# Altium schematic sheet PAGE2 - EnviromentalBoard.SchDoc
size A3
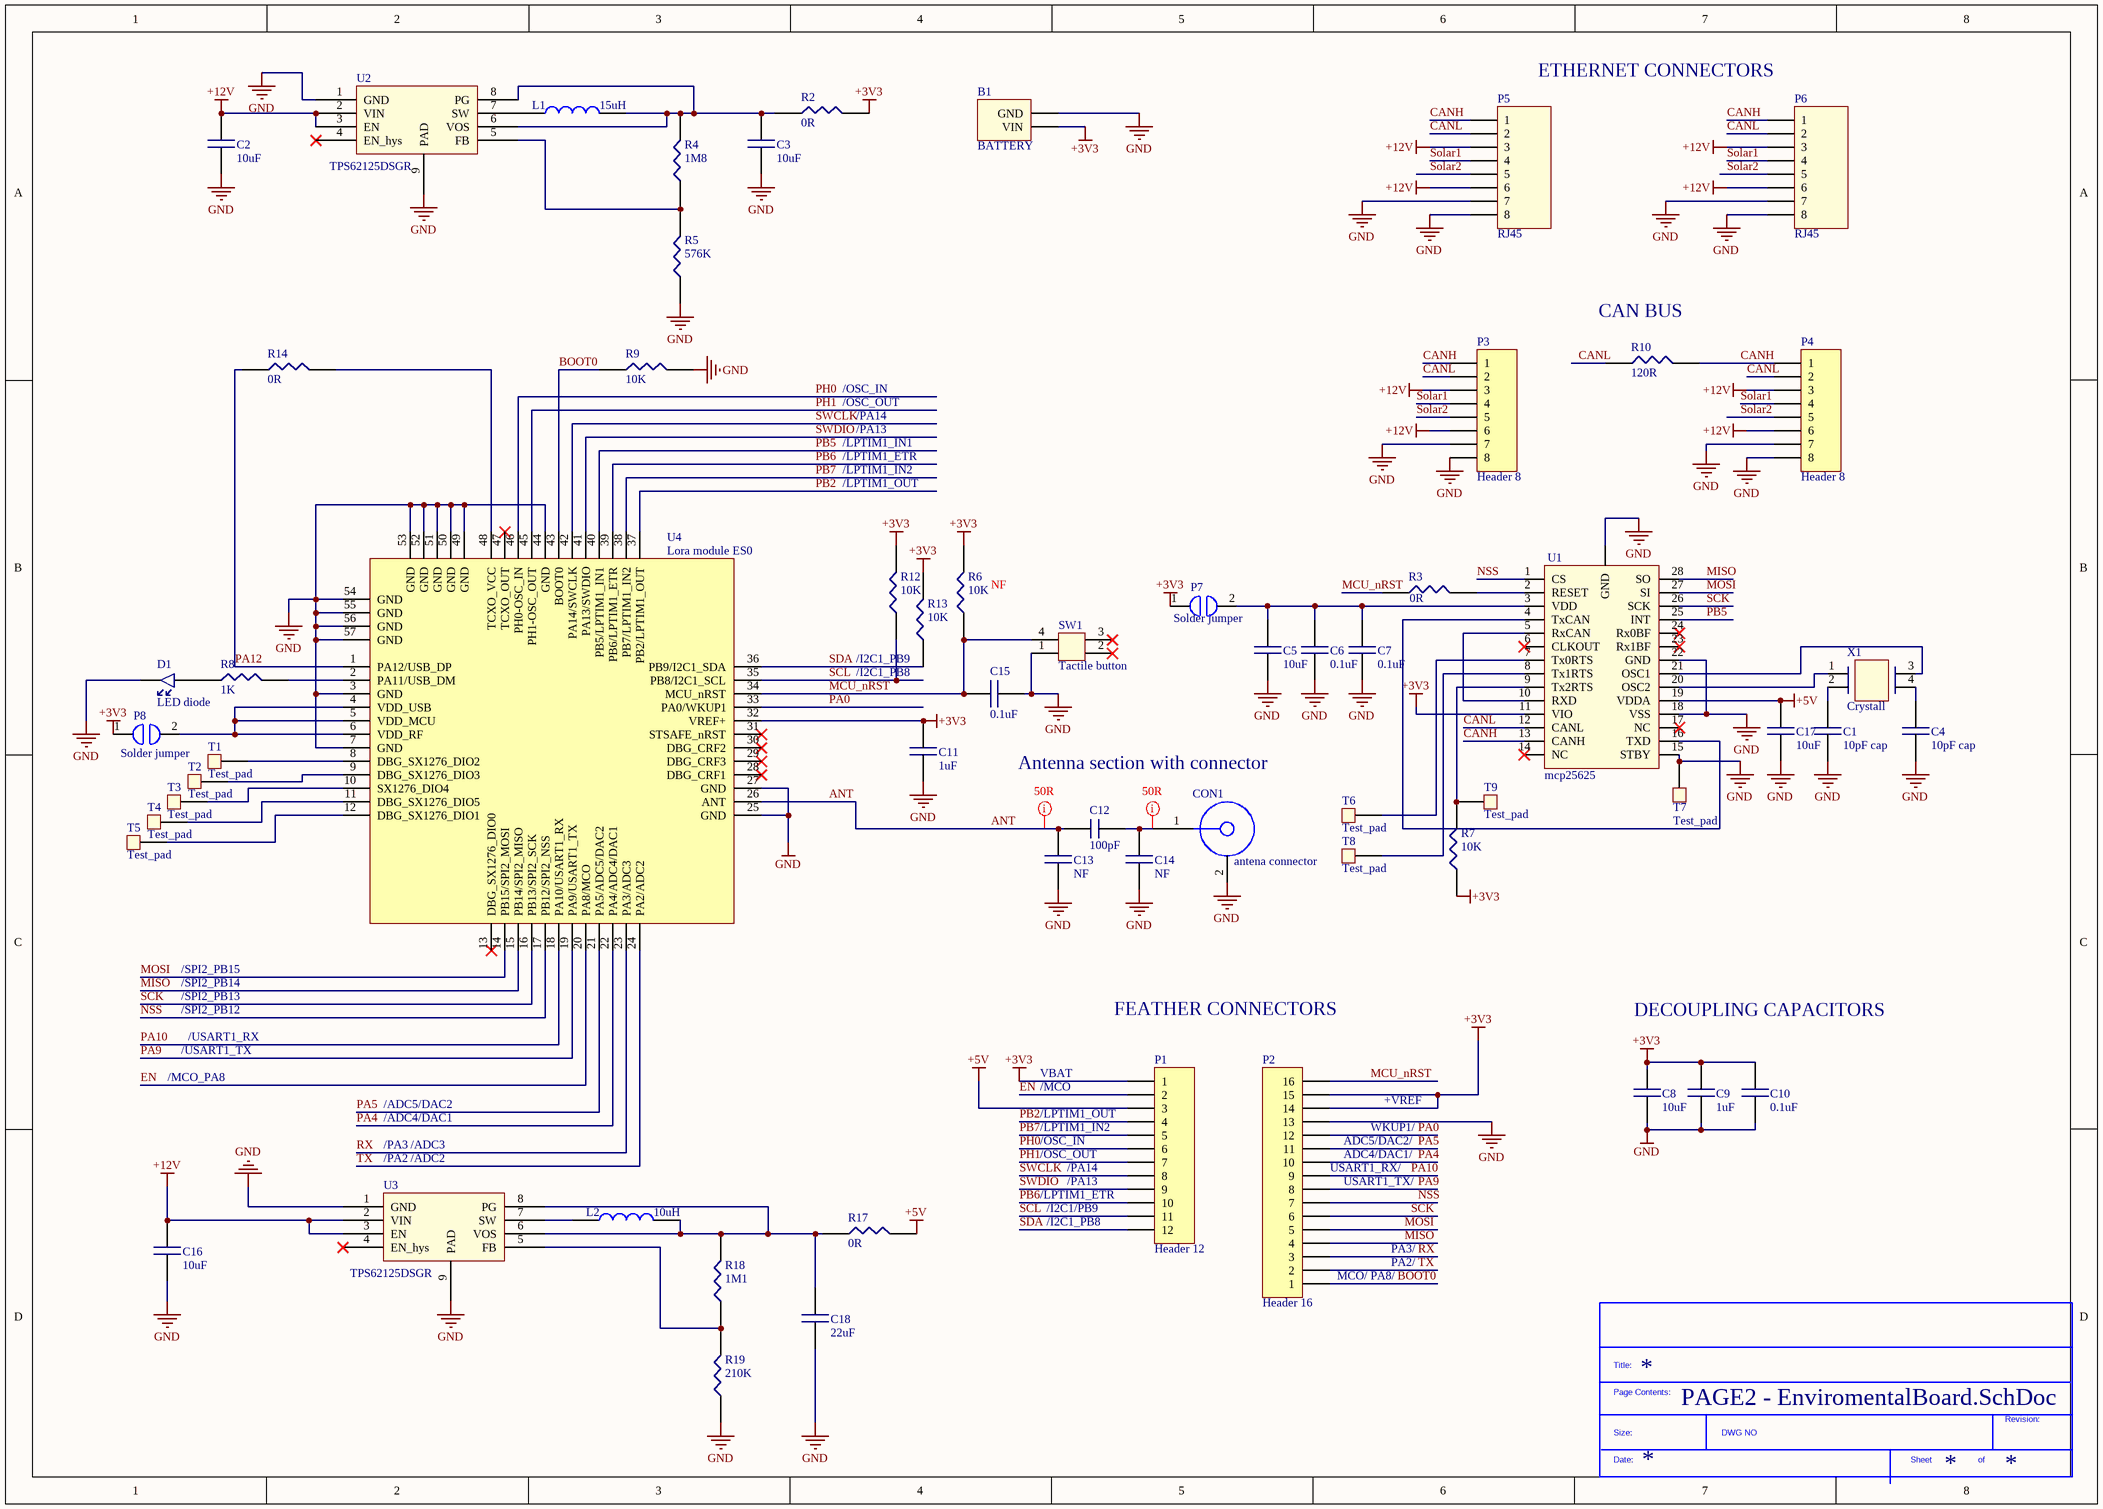
[diagram p0: PAGE2 - EnviromentalBoard.SchDoc]

## Parts
*?  SDTitleBlock  (value not drawn)  (graphical)
B1  BATTERY  [BAT_CON]
C1  10pF cap  [0603Cap]
C2  10uF  [0603Cap]
C3  10uF  [0603Cap]
C4  10pF cap  [0603Cap]
C5  10uF  [0603Cap]
C6  0.1uF  [0603Cap]
C7  0.1uF  [0603Cap]
C8  10uF  [0603Cap]
C9  1uF  [0603Cap]
C10  0.1uF  [0603Cap]
C11  1uF  [0603Cap]
C12  100pF  [0402CAP]
C13  NF  [0402CAP]
C14  NF  [0402CAP]
C15  0.1uF  [0603Cap]
C16  10uF  [0603Cap]
C17  10uF  [0603Cap]
C18  22uF  [0603Cap]
CON1  antena connector  [uFL SMD CONNECTOR]
D1  LED diode  [LED]
L1  15uH  [Inductor 3.0x2.5]
L2  10uH  [Inductor 3.0x2.5]
P1  Header 12  [HDR1X12]
P2  Header 16  [HDR1X16]
P3  Header 8  [HDR1X8]
P4  Header 8  [HDR1X8]
P5  RJ45  [EThernet conn]
P6  RJ45  [EThernet conn]
P7  Solder jumper  [SOLDER JUMPER]
P8  Solder jumper  [SOLDER JUMPER]
R2  0R  [0603Res]
R3  0R  [0603Res]
R4  1M8  [0603Res]
R5  576K  [0603Res]
R6  10K  [0603Res]
R7  10K  [0603Res]
R8  1K  [0603Res]
R9  10K  [0603Res]
R10  120R  [0603Res]
R12  10K  [0603Res]
R13  10K  [0603Res]
R14  0R  [0603Res]
R17  0R  [0603Res]
R18  1M1  [0603Res]
R19  210K  [0603Res]
SW1  Tactile button  [Tactile button]
T1  Test_pad  [Test_Pad]
T2  Test_pad  [Test_Pad]
T3  Test_pad  [Test_Pad]
T4  Test_pad  [Test_Pad]
T5  Test_pad  [Test_Pad]
T6  Test_pad  [Test_Pad]
T7  Test_pad  [Test_Pad]
T8  Test_pad  [Test_Pad]
T9  Test_pad  [Test_Pad]
U1  mcp25625  [MCP25625]
U2  TPS62125DSGR  [WSON-Voltage regulator]
U3  TPS62125DSGR  [WSON-Voltage regulator]
U4  Lora module ES0  [LORA MODULE ES0]
X1  Crystall  [IQXC-42]

## Nets
+3V3: B1.1(VIN) C8.1 C9.1 C10.2 C11.2 P1.1 P2.14 P2.15 P7.1 P8.1 R2.2 R6.2 R7.1 R12.2 R13.2 U1.11(VIO) U4.32(VREF+)
+5V: C17.1 P1.3 R17.2 U1.19(VDDA)
+12V: C2.1 C16.1 P3.3 P3.6 P4.3 P4.6 P5.3 P5.6 P6.3 P6.6 U2.2(VIN) U2.3(EN) U3.2(VIN) U3.3(EN)
GND: B1.2(GND) C1.1 C2.2 C3.2 C4.1 C5.2 C6.1 C7.1 C8.2 C9.2 C10.1 C11.1 C13.1 C14.1 C15.2 C16.2 C17.2 C18.1 CON1.2 D1.1 P2.13 P3.7 P3.8 P4.7 P4.8 P5.7 P5.8 P6.7 P6.8 R5.1 R9.2 R19.1 SW1.1 T7.1 U1.15(STBY) U1.18(VSS) U1.22(GND) U1.29(GND) U2.1(GND) U2.9(PAD) U3.1(GND) U3.9(PAD) U4.3(GND) U4.7(GND) U4.25(GND) U4.27(GND) U4.44(GND) U4.49(GND) U4.50(GND) U4.51(GND) U4.52(GND) U4.53(GND) U4.54(GND) U4.55(GND) U4.56(GND) U4.57(GND)
ANT: C12.1 C13.2 U4.26(ANT)
BOOT0: P2.1 R9.1 U4.43(BOOT0)
CANH: P3.1 P4.1 P5.1 P6.1 R10.2 U1.13(CANH)
CANL: P3.2 P4.2 P5.2 P6.2 R10.1 U1.12(CANL)
EN: P1.2 U4.20(PA8/MCO)
MCU_nRST: C15.1 P2.16 R3.1 R6.1 SW1.4 U4.34(MCU_nRST)
MISO: P2.4 U1.28(SO) U4.15(PB14/SPI2_MISO)
MOSI: P2.5 U1.27(SI) U4.14(PB15/SPI2_MOSI)
NSS: P2.7 U1.1(CS) U4.17(PB12/SPI2_NSS)
PA0: P2.12 U4.33(PA0/WKUP1)
PA4: P2.10 U4.22(PA4/ADC4/DAC1)
PA5: P2.11 U4.21(PA5/ADC5/DAC2)
PA9: P2.8 U4.19(PA9/USART1_TX)
PA10: P2.9 U4.18(PA10/USART1_RX)
PA12: R14.1 U4.1(PA12/USB_DP)
PB2: P1.4 U4.37(PB2/LPTIM1_OUT)
PB5: U1.25(INT) U4.40(PB5/LPTIM1_IN1)
PB6: P1.10 U4.39(PB6/LPTIM1_ETR)
PB7: P1.5 U4.38(PB7/LPTIM1_IN2)
PH0: P1.6 U4.46(PH0-OSC_IN)
PH1: P1.7 U4.45(PH1-OSC_OUT)
RX: P2.3 U4.23(PA3/ADC3)
SCK: P2.6 U1.26(SCK) U4.16(PB13/SPI2_SCK)
SCL: P1.11 R12.1 U4.35(PB8/I2C1_SCL)
SDA: P1.12 R13.1 U4.36(PB9/I2C1_SDA)
Solar1: P3.4 P4.4 P5.4 P6.4
Solar2: P3.5 P4.5 P5.5 P6.5
SWCLK: P1.8 U4.42(PA14/SWCLK)
SWDIO: P1.9 U4.41(PA13/SWDIO)
TX: P2.2 U4.24(PA2/ADC2)
NetC1_2: C1.2 X1.2
NetC3_1: C3.1 L1.2 R2.1 R4.2 U2.6(VOS) U2.8(PG)
NetC4_2: C4.2 X1.4
NetC5_1: C5.1 C6.2 C7.2 P7.2 U1.3(VDD)
NetC12_2: C12.2 C14.2 CON1.1
NetC18_2: C18.2 L2.2 R17.1 R18.2 U3.6(VOS) U3.8(PG)
NetD1_2: D1.2 R8.1
NetL1_1: L1.1 U2.7(SW)
NetL2_1: L2.1 U3.7(SW)
NetP8_2: P8.2 U4.4(VDD_USB) U4.5(VDD_MCU) U4.6(VDD_RF)
NetR3_2: R3.2 U1.2(RESET)
NetR4_1: R4.1 R5.2 U2.5(FB)
NetR7_2: R7.2 T9.1 U1.9(Tx2RTS)
NetR8_2: R8.2 U4.2(PA11/USB_DM)
NetR14_2: R14.2 U4.48(TCXO_VCC)
NetR18_1: R18.1 R19.2 U3.5(FB)
NetT1_1: T1.1 U4.8(DBG_SX1276_DIO2)
NetT2_1: T2.1 U4.9(DBG_SX1276_DIO3)
NetT3_1: T3.1 U4.10(SX1276_DIO4)
NetT4_1: T4.1 U4.11(DBG_SX1276_DIO5)
NetT5_1: T5.1 U4.12(DBG_SX1276_DIO1)
NetT6_1: T6.1 U1.7(Tx0RTS)
NetT8_1: T8.1 U1.8(Tx1RTS)
NetU1_4: U1.4(TxCAN) U1.16(TXD)
NetU1_5: U1.5(RxCAN) U1.10(RXD)
NetU1_20: U1.20(OSC2) X1.1
NetU1_21: U1.21(OSC1) X1.3

Not connected (* = marked no-connect by the designer): SW1 2* 3*; U1 6(CLKOUT)* 14(NC)* 17(NC)* 23(Rx1BF)* 24(Rx0BF)*; U2 4(EN_hys)*; U3 4(EN_hys)*; U4 13(DBG_SX1276_DIO0)* 28(DBG_CRF1)* 29(DBG_CRF3)* 30(DBG_CRF2)* 31(STSAFE_nRST)* 47(TCXO_OUT)*

## Layout directives
net class 50R; rule Clearance Constraint [Clearance = 6.2mil]: ANT, NetC12_2

## Notes on the sheet
- ETHERNET CONNECTORS
- (near R10) CAN BUS
- /OSC_IN
- /OSC_OUT
- /LPTIM1_IN1
- /PA14
- /PA13
- /LPTIM1_ETR
- /LPTIM1_IN2
- /LPTIM1_OUT
- (near R6) NF
- (near R13) /I2C1_PB9
- (near R13) /I2C1_PB8
- Antenna section with connector
- /SPI2_PB15
- /SPI2_PB14
- /SPI2_PB13
- /USART1_TX
- /SPI2_PB12
- /USART1_RX
- FEATHER CONNECTORS
- DECOUPLING CAPACITORS
- /MCO_PA8
- /ADC5/DAC2
- /ADC4/DAC1
- (near P1) /LPTIM1_OUT
- /MCO
- VBAT
- +VREF
- /PA3
- (near U3) /PA2
- /ADC3
- (near U3) /ADC2
- (near P1) /LPTIM1_IN2
- (near P2) USART1_RX/
- (near P2) ADC4/DAC1/
- (near P2) USART1_TX/
- (near P2) ADC5/DAC2/
- WKUP1/
- (near P1) /LPTIM1_ETR
- (near P1) /I2C1/PB9
- (near P1) /I2C1_PB8
- PA3/
- (near P2) MCO/
- PA8/
- PA2/
- (in symbol SDTitleBlock) Title:; Page Contents:; Revision:; Size:; DWG NO; Date:; Sheet; of

## Library data of the parts
B1 = 1862: JST-PH 2-Pin SMT Right Angle Breakout Board; Manufacturer: Adafruit Industries; Supplier 1: Mouser; Manufacturer Part Number: 1862; Stock 1: 115; Pricing 1: 1=1.5, 10=1.5, 50=1.5, 100=1.5, 1000=1.5, 10000=1.5 (USD); Supplier Part Number 1: 485-1862
C1 C4 = 10pF: Cap Ceramic 10pF 50V X7R 10% SMD 0603 125C T/R; Manufacturer: Kyocera AVX; Manufacturer Part Number: 06035C100KAT2A; Supplier 1: Farnell; Stock 1: 0; Capacitance: 10 pF; Case Size/Dimension: 0603; Dielectric: X7R; Tolerance (%): ±10 %; Rated Voltage: 50 V; ComponentLink1URL: https://datasheet.ciiva.com/204/cx7r-204167.pdf; ComponentLink1Description: https://datasheet.ciiva.com/204/cx7r-204167.pdf; ComponentLink2URL: https://datasheet.ciiva.com/28611/1679506-28611544.pdf; ComponentLink2Description: https://datasheet.ciiva.com/28611/1679506-28611544.pdf; ComponentLink3URL: https://datasheet.ciiva.com/22677/1679506-22677033.pdf; ComponentLink3Description: https://datasheet.ciiva.com/22677/1679506-22677033.pdf; ComponentLink4URL: https://datasheet.ciiva.com/16327/cx7r-16327067.pdf; ComponentLink4Description: https://datasheet.ciiva.com/16327/cx7r-16327067.pdf; ComponentLink5URL: https://datasheet.ciiva.com/5416/cx7r-5416268.pdf; ComponentLink5Description: https://datasheet.ciiva.com/5416/cx7r-5416268.pdf; ComponentLink6URL: https://datasheet.ciiva.com/15212/getdatasheetpartid-317346-15212284.pdf; ComponentLink6Description: https://datasheet.ciiva.com/15212/getdatasheetpartid-317346-15212284.pdf; Supplier Part Number 1: 2665201
C2 C3 C5 C8 C16 C17 = 10uF Cap: MURATA         ZRB18AR61E106ME01L             SMD Multilayer Ceramic Capacitor, 0603 [1608 Metric], 10 F, 25 V,  20%, X5R, ZRA Series; Capacitance: 10µF; Voltage - Rated: 25V; Supplier 1: Farnell; Manufacturer: Murata; Manufacturer Part Number: ZRB18AR61E106ME01L; Stock 1: 0; Category: Capacitors; Family: Ceramic Capacitors; Series: ZRB; Packaging: Tape & Reel (TR); Tolerance: ±20%; Temperature Coefficient: X5R; Mounting Type: Surface Mount, MLCC; Operating Temperature: -55°C ~ 85°C; Applications: Acoustic Noise Reduction; Ratings: -; Package / Case: 0603 (1608 Metric); Size / Dimension: 0.063" L x 0.031" W (1.60mm x 0.80mm); Height - Seated (Max): -; Thickness (Max): 0.047" (1.20mm); Lead Spacing: -; Features: Interposer Termination; Lead Style: -; ComponentLink1URL: http://www.farnell.com/datasheets/2243360.pdf; ComponentLink1Description: http://www.farnell.com/datasheets/2243360.pdf; ComponentLink2URL: http://www.farnell.com/datasheets/2163235.pdf; ComponentLink2Description: http://www.farnell.com/datasheets/2163235.pdf; ComponentLink3URL: http://search.murata.co.jp/Ceramy/image/img/A01X/G101/ENG/ZRB18AR61E106ME01-01.pdf; ComponentLink3Description: http://search.murata.co.jp/Ceramy/image/img/A01X/G101/ENG/ZRB18AR61E106ME01-01.pdf; Supplier Part Number 1: 2469398; Pricing 1: 5=0.411, 50=0.187, 250=0.142, 500=0.0978, 1500=0.091 (GBP)
C6 C7 C10 C15 = 0.1uF: Multilayer Ceramic Capacitors MLCC - SMD/SMT .1uF 50Volts X7R +/-10% 0603 STD; Manufacturer: KEMET; Manufacturer Part Number: C0603C104K4RAC7081; Capacitance: 0.1µF; Ceramic Capacitor Case: 0603 [1608 Metric]; Voltage Rating: 16V; Capacitance Tolerance: ± 10%; Product Range: C Series; SVHC: No SVHC (15-Jun-2015); Supplier 1: Farnell; Stock 1: 131460; Pricing 1: 10=0.0639, 100=0.0337, 500=0.0247, 2500=0.0209 (EUR); Packaging: Cut Tape; ComponentLink1URL: http://www.farnell.com/datasheets/2112158.pdf; ComponentLink1Description: http://www.farnell.com/datasheets/2112158.pdf; ComponentLink2URL: http://www.farnell.com/datasheets/2316283.pdf; ComponentLink2Description: http://www.farnell.com/datasheets/2316283.pdf; ComponentLink3URL: https://api.kemet.com/component-edge/download/datasheet/C0603C104K4RAC7081.pdf; ComponentLink3Description: https://api.kemet.com/component-edge/download/datasheet/C0603C104K4RAC7081.pdf; Supplier Part Number 1: 2522597; Dielectric Characteristic: X7R; Operating Temperature Min: -55°C; Operating Temperature Max: 125°C; Automotive Qualification Standard: -; MSL: MSL 1 - Unlimited
C9 C11 = 1uF: 1µF 50V Ceramic Capacitor X5R 0603 (1608 Metric) 0.063" L x 0.031" W (1.60mm x 0.80mm); Manufacturer: TDK; Manufacturer Part Number: C1608X5R1E105K080AC; PCN Part Number: MLCC Part Number Change 30/Nov/2012; Tolerance: ±10%; Voltage - Rated: 25V; Product Training Modules: C Series General Applications SEAT, CCV, and TVCL Design Tools Guide to Replacing an Electrolytic Capacitor with an MLCC; Design Resources: 20 W Non-Isolated Buck LED Driver Using PL LNK460KG; Online Catalog: C Series, General Purpose; Other Names: 445-5146-6; Supplier 1: Farnell; Stock 1: 0; Pricing 1: 10=0.0585, 100=0.0449, 500=0.0335, 1000=0.0279 (GBP); Category: Capacitors; Family: Ceramic Capacitors; Series: C; Packaging: Digi-Reel®; Capacitance: 1µF; Temperature Coefficient: X5R; Mounting Type: Surface Mount, MLCC; Operating Temperature: -55°C ~ 85°C; Applications: General Purpose; Ratings: -; Package / Case: 0603 (1608 Metric); Size / Dimension: 0.063" L x 0.031" W (1.60mm x 0.80mm); Height - Seated (Max): -; Thickness (Max): 0.037" (0.95mm); Lead Spacing: -; Features: -; Lead Style: -; ComponentLink1URL: https://datasheet.ciiva.com/28451/1796654-28451158.pdf; ComponentLink1Description: https://datasheet.ciiva.com/28451/1796654-28451158.pdf; ComponentLink2URL: https://datasheet.ciiva.com/16394/e412-c-16394039.pdf; ComponentLink2Description: https://datasheet.ciiva.com/16394/e412-c-16394039.pdf; Supplier Part Number 1: 2346891; RoHS Information: RoHS Certificate-MLCC; Standard Package: 1; ComponentLink3URL: https://datasheet.ciiva.com/6292/tdkmlcccaprange-6292456.pdf; ComponentLink3Description: https://datasheet.ciiva.com/6292/tdkmlcccaprange-6292456.pdf; ComponentLink4URL: https://datasheet.ciiva.com/6292/tdkmlcccaprange-6292458.pdf; ComponentLink4Description: https://datasheet.ciiva.com/6292/tdkmlcccaprange-6292458.pdf; ComponentLink5URL: https://datasheet.ciiva.com/22676/1571323-22676922.pdf; ComponentLink5Description: https://datasheet.ciiva.com/22676/1571323-22676922.pdf
C12 = 0F: MULTICOMP         MC0402B101K500CT            SMD Multilayer Ceramic Capacitor, MC Series, 100 pF,  10%, X7R, 50 V, 0402 [1005 Metric]; Product Range: MULTICOMP - MC Series; SVHC: To Be Advised; Voltage Rating: 50V; Supplier 1: Farnell; Manufacturer: Multicomp; Manufacturer Part Number: MC0402B101K500CT; Stock 1: 250; Pricing 1: 10=0.0386, 100=0.0239, 500=0.0142, 2500=0.0091 (EUR); Capacitance: 100pF; Capacitance Tolerance: ± 10%; Capacitor Case Style: 0402 [1005 Metric]; Capacitor Terminals: SMD; Ceramic Capacitor Case: 0402 [1005 Metric]; Dielectric Characteristic: X7R; MSL: -; Operating Temperature Max: 125°C; Operating Temperature Min: -55°C; Packaging: Tape & Reel; ComponentLink1URL: https://datasheet.ciiva.com/36858/1870456-36858427.pdf; ComponentLink1Description: https://datasheet.ciiva.com/36858/1870456-36858427.pdf; ComponentLink2URL: https://datasheet.ciiva.com/36857/1825492-36857949.pdf; ComponentLink2Description: https://datasheet.ciiva.com/36857/1825492-36857949.pdf; ComponentLink3URL: https://datasheet.ciiva.com/36858/1870456-36858493.pdf; ComponentLink3Description: https://datasheet.ciiva.com/36858/1870456-36858493.pdf; Supplier Part Number 1: 1758968
C13 C14 = Cap0402
C18 = 22uF: MURATA         ZRB18AR60J226ME01L             SMD Multilayer Ceramic Capacitor, 0603 [1608 Metric], 22 F, 6.3 V,  20%, X5R, ZRA Series; Capacitance: 22µF; Voltage - Rated: 6.3V; Supplier 1: Farnell; Manufacturer: Murata; Manufacturer Part Number: ZRB18AR60J226ME01L; Stock 1: 4282; Pricing 1: 5=0.54, 50=0.246, 250=0.175, 500=0.129, 1500=0.111 (EUR); Category: Capacitors; Family: Ceramic Capacitors; Series: ZRB; Packaging: Tape & Reel (TR); Tolerance: ±20%; Temperature Coefficient: X5R; Mounting Type: Surface Mount, MLCC; Operating Temperature: -55°C ~ 85°C; Applications: Acoustic Noise Reduction; Ratings: -; Package / Case: 0603 (1608 Metric); Size / Dimension: 0.063" L x 0.031" W (1.60mm x 0.80mm); Height - Seated (Max): -; Thickness (Max): 0.047" (1.20mm); Lead Spacing: -; Features: Derating Recommended, Interposer Termination; Lead Style: -; Supplier Part Number 1: 2469395
CON1 = U.FL-R-SMT-1(10): CONN UMC JACK STR 50 OHM SMD; Manufacturer: Hirose; Featured Product: U.FL Series Connectors; Connector Style: U.FL, Ultra Miniature Coaxial; Connector Type: Receptacle, Male Pin; Contact Termination: Solder; Impedance: 50 Ohm; Frequency - Max: 6GHz; Body Material: Phosphor Bronze; Body Finish: Silver; Center Contact Material: Brass; Center Contact Plating: Gold; Dielectric Material: Liquid Crystal Polymer (LCP); Online Catalog: UMCC (Ultra Miniature Coax Connectors), U.FL Series; Other Names: H11891TR  Q5400621  U.FL-R-SMT-1 10  U.FL-R-SMT-1(10)-ND  UFLRSMT110; Supplier 1: Farnell; Manufacturer Part Number: U.FL-R-SMT-1(10); Stock 1: 38546; Pricing 1: 10=0.49, 100=0.476, 500=0.424, 1000=0.394, 2500=0.386, 5000=0.378 (GBP); Standard Package: 2,500; Category: Connectors, Interconnects; Family: Coaxial Connectors (RF); Series: U.FL; Packaging: Tape & Reel (TR); Shield Termination: Solder; Mounting Type: Surface Mount; Cable Group: -; Fastening Type: Snap-On; Features: -; Housing Color: Beige; Ingress Protection: -; Voltage Rating: -; Operating Temperature: -40°C ~ 90°C; ComponentLink1URL: https://datasheet.ciiva.com/11762/0900766b8105243f-11762474.pdf; ComponentLink1Description: https://datasheet.ciiva.com/11762/0900766b8105243f-11762474.pdf; ComponentLink2URL: https://datasheet.ciiva.com/7651/91524-7651914.pdf; ComponentLink2Description: https://datasheet.ciiva.com/7651/91524-7651914.pdf; ComponentLink3URL: https://datasheet.ciiva.com/7651/91524-7651915.pdf; ComponentLink3Description: https://datasheet.ciiva.com/7651/91524-7651915.pdf; Supplier Part Number 1: 1688077
D1 = LED: Manufacturer: Kingbright; Manufacturer Part Number: KPG1-1608VGC-TT-5MAV; Supplier 1: Farnell; Stock 1: 3955; Pricing 1: 5=0.579, 25=0.542, 100=0.504, 250=0.48, 500=0.443, 1000=0.406 (EUR); ComponentLink1URL: http://www.farnell.com/datasheets/2163492.pdf; ComponentLink1Description: http://www.farnell.com/datasheets/2163492.pdf; Supplier Part Number 1: 2671383
L1 = 15uH inductor: Fixed Inductors 15uH 0.28ohms 0.56A; Manufacturer: TDK; Manufacturer Part Number: VLF302515MT-150M; Unit PriceUSD: VLF-MT; Type: Wirewound; Material - Core: Ferrite; Inductance: 15µH; Tolerance: ±20%; Current Rating: 500mA; Shielding: Shielded; DC Resistance (DCR): 330 mOhm Max; Frequency - Test: 1MHz; Dynamic Catalog: VLF-M and VLF-MT Series; Other Names: 445-9635-6; Supplier 1: Farnell; Stock 1: 1162; Pricing 1: 5=1.46, 50=0.912, 250=0.895, 500=0.698, 1000=0.621, 2000=0.589, 10000=0.557 (EUR); Standard Package: 1; Category: Inductors, Coils, Chokes; Family: Fixed Inductors; Series: VLF-MT; Packaging: Digi-Reel®; Current - Saturation: 500mA; Operating Temperature: -40°C ~ 105°C; Mounting Type: Surface Mount; Package / Case: Non Standard; Size / Dimension: 0.118" L x 0.098" W (3.00mm x 2.50mm); Height - Seated (Max): 0.059" (1.50mm); ComponentLink1URL: https://datasheet.ciiva.com/46449/1759590-46449866.pdf; ComponentLink1Description: https://datasheet.ciiva.com/46449/1759590-46449866.pdf; Supplier Part Number 1: 2455319
L2 = 10uH: COILCRAFT   LPS3314-103MRB   INDUCTOR, SHLD, 10UH, 20%, 0.65A, SMD; Product Range: LPS3314 Series; Inductance: 10µH; RMS Current (Irms): 650mA; Saturation Current (Isat): 660mA; Inductor Construction: Shielded; DC Resistance Max: 0.33ohm; Power Inductor Case: 3.3mm x 3.3mm x 1.3mm; SVHC: No SVHC (15-Jun-2015); Supplier 1: Farnell; Manufacturer: Coilcraft; Manufacturer Part Number: LPS3314-103MRB; Stock 1: 67; Pricing 1: 1=0.892, 250=0.701, 500=0.55 (EUR); Inductance Tolerance: ± 20%; Packaging: Cut Tape; ComponentLink1URL: https://datasheet.ciiva.com/46384/1805322-46384791.pdf; ComponentLink1Description: https://datasheet.ciiva.com/46384/1805322-46384791.pdf; ComponentLink2URL: https://datasheet.ciiva.com/46438/1805322-46438520.pdf; ComponentLink2Description: https://datasheet.ciiva.com/46438/1805322-46438520.pdf; Supplier Part Number 1: 2408046
P1 = Header 12: Header, 12-Pin; LatestRevisionDate: 17-Jul-2002; LatestRevisionNote: Re-released for DXP Platform.; Publisher: Altium Limited
P2 = Header 16: Header, 16-Pin; LatestRevisionDate: 17-Jul-2002; LatestRevisionNote: Re-released for DXP Platform.; Publisher: Altium Limited
P3 P4 = Header 8: Header, 8-Pin; LatestRevisionDate: 17-Jul-2002; LatestRevisionNote: Re-released for DXP Platform.; Publisher: Altium Limited
P5 P6 = 44620-0001: MODULAR JACK; Manufacturer: Molex; Number of Contacts: 8; Rad Hard: No; Gender: RCP; Pitch: 2.04 mm; Body Orientation: Right Angle; Supplier 1: Farnell; Manufacturer Part Number: 44620-0001; Stock 1: 1202; Pricing 1: 1=0.689, 50=0.675, 100=0.67, 250=0.669, 500=0.668, 1000=0.667 (EUR); Type: RJ-45; Termination Method: Solder; Mounting: Through Hole; Category: Connector Telephone and Telecom; ComponentLink1URL: https://datasheet.ciiva.com/26929/getdatasheetpartid-767379-26929525.pdf; ComponentLink1Description: https://datasheet.ciiva.com/26929/getdatasheetpartid-767379-26929525.pdf; ComponentLink2URL: https://datasheet.ciiva.com/19472/2040276-19472615.pdf; ComponentLink2Description: https://datasheet.ciiva.com/19472/2040276-19472615.pdf; ComponentLink3URL: https://datasheet.ciiva.com/30213/71510446200001-modular-jacks-plug-30213975.pdf; ComponentLink3Description: https://datasheet.ciiva.com/30213/71510446200001-modular-jacks-plug-30213975.pdf; ComponentLink4URL: https://datasheet.ciiva.com/4562/0446200001-modular-jacks-plug-145952-4562632.pdf; ComponentLink4Description: https://datasheet.ciiva.com/4562/0446200001-modular-jacks-plug-145952-4562632.pdf; ComponentLink5URL: https://datasheet.ciiva.com/16074/832720446200001-modular-jacks-plug-16074650.pdf; ComponentLink5Description: https://datasheet.ciiva.com/16074/832720446200001-modular-jacks-plug-16074650.pdf; ComponentLink6URL: https://datasheet.ciiva.com/1107/66995-1107778.pdf; ComponentLink6Description: https://datasheet.ciiva.com/1107/66995-1107778.pdf; ComponentLink7URL: https://datasheet.ciiva.com/9393/0446200001-modular-jacks-plug-9393019.pdf; ComponentLink7Description: https://datasheet.ciiva.com/9393/0446200001-modular-jacks-plug-9393019.pdf; ComponentLink8URL: https://datasheet.ciiva.com/16649/0446200001-modular-jacks-plug-16649582.pdf; ComponentLink8Description: https://datasheet.ciiva.com/16649/0446200001-modular-jacks-plug-16649582.pdf; Supplier Part Number 1: 2782009
P7 P8 = Solder_Jumper
R2 R3 R14 R17 = 0R: RES SMD 0.0OHM JUMPER 1/10W 0603; Manufacturer: Vishay; Manufacturer Part Number: CRCW06030000Z0EA; EDA / CAD Models: Download from Accelerated Designs; Resistance (Ohms): 0.0; Power (Watts): 0.1W, 1/10W; Online Catalog: CRCW - Automotive Series; Kits: 541-1419-ND  - RESISTOR KIT 0-1M 1/10W 6100PCS; Other Names: 541-0.0GCT; Supplier 1: Farnell; Stock 1: 1145000; Pricing 1: 5000=0.0046 (EUR); Standard Package: 1; Category: Resistors; Family: Chip Resistor - Surface Mount; Series: CRCW; Packaging: Cut Tape (CT); Tolerance: Jumper; Composition: Thick Film; Features: Automotive AEC-Q200; Temperature Coefficient: -; Operating Temperature: -55°C ~ 155°C; Package / Case: 0603 (1608 Metric); Supplier Device Package: 0603 (1608 Metric); Size / Dimension: 0.061" L x 0.033" W (1.55mm x 0.85mm); Height: 0.020" (0.50mm); Number of Terminations: 2; ComponentLink1URL: https://datasheet.ciiva.com/2461/dcrcwe3-2461968.pdf; ComponentLink1Description: https://datasheet.ciiva.com/2461/dcrcwe3-2461968.pdf; ComponentLink2URL: https://datasheet.ciiva.com/2461/dcrcwe3-2461969.pdf; ComponentLink2Description: https://datasheet.ciiva.com/2461/dcrcwe3-2461969.pdf; ComponentLink3URL: https://datasheet.ciiva.com/2461/dcrcwe3-2461970.pdf; ComponentLink3Description: https://datasheet.ciiva.com/2461/dcrcwe3-2461970.pdf; ComponentLink4URL: https://datasheet.ciiva.com/8340/dcrcwe3-8340197.pdf; ComponentLink4Description: https://datasheet.ciiva.com/8340/dcrcwe3-8340197.pdf; ComponentLink5URL: https://datasheet.ciiva.com/16941/dcrcw-16941302.pdf; ComponentLink5Description: https://datasheet.ciiva.com/16941/dcrcw-16941302.pdf; ComponentLink6URL: https://datasheet.ciiva.com/16199/dcrcwe3-16199063.pdf; ComponentLink6Description: https://datasheet.ciiva.com/16199/dcrcwe3-16199063.pdf; ComponentLink7URL: https://datasheet.ciiva.com/16725/70201119-16725175.pdf; ComponentLink7Description: https://datasheet.ciiva.com/16725/70201119-16725175.pdf; ComponentLink8URL: https://datasheet.ciiva.com/26316/fld-crcw-e3-data-en-26316615.pdf; ComponentLink8Description: https://datasheet.ciiva.com/26316/fld-crcw-e3-data-en-26316615.pdf; ComponentLink9URL: https://datasheet.ciiva.com/5544/dcrcwe3-109170-5544344.pdf; ComponentLink9Description: https://datasheet.ciiva.com/5544/dcrcwe3-109170-5544344.pdf; ComponentLink10URL: https://datasheet.ciiva.com/7841/1720486-7841816.pdf; ComponentLink10Description: https://datasheet.ciiva.com/7841/1720486-7841816.pdf; ComponentLink11URL: https://datasheet.ciiva.com/7841/1720486-7841817.pdf; ComponentLink11Description: https://datasheet.ciiva.com/7841/1720486-7841817.pdf; ComponentLink12URL: https://datasheet.ciiva.com/7841/125364-7841818.pdf; ComponentLink12Description: https://datasheet.ciiva.com/7841/125364-7841818.pdf; ComponentLink13URL: https://datasheet.ciiva.com/16721/70201119-16721450.pdf; ComponentLink13Description: https://datasheet.ciiva.com/16721/70201119-16721450.pdf; Supplier Part Number 1: 2122112
R4 = 1.8Mohm Res: Manufacturer: Multicomp; Manufacturer Part Number: MCHVR03FTFX1804; Supplier 1: Farnell; Stock 1: 4880; Pricing 1: 10=0.0383, 100=0.0291, 500=0.0206, 1000=0.0165, 2500=0.0138, 5000=0.0119, 25000=0.0085 (EUR); Supplier Part Number 1: 2825653
R5 = 576K Res: Res Thick Film 0603 576K Ohm 1% 0.1W(1/10W) ±100ppm/C Molded SMD Automotive Punched T/R; Manufacturer: Panasonic; Manufacturer Part Number: ERJ-3EKF5763V; EDA / CAD Models: Download from Accelerated Designs; Power (Watts): 0.1W, 1/10W; Temperature Coefficient: ±100ppm/°C; Online Catalog: ERJ Series; Kits: RSM5H-ND  - RES KIT 100K-1M 1/10W 4850PCS; Other Names: ERJ-3EKF5763 ERJ3EKF5763 P576KHCT; Supplier 1: Farnell; Stock 1: 39830; Pricing 1: 10=0.0416, 100=0.0243, 500=0.0181, 1000=0.0162 (EUR); Standard Package: 1; Category: Resistors; Family: Chip Resistor - Surface Mount; Series: ERJ; Packaging: Cut Tape (CT); Resistance (Ohms): 576k; Tolerance: ±1%; Composition: Thick Film; Features: Automotive AEC-Q200; Operating Temperature: -55°C ~ 155°C; Package / Case: 0603 (1608 Metric); Supplier Device Package: 0603; Size / Dimension: 0.063" L x 0.031" W (1.60mm x 0.80mm); Height: 0.022" (0.55mm); Number of Terminations: 2; ComponentLink1URL: https://datasheet.ciiva.com/9181/aoa0000ce2-9181015.pdf; ComponentLink1Description: https://datasheet.ciiva.com/9181/aoa0000ce2-9181015.pdf; ComponentLink2URL: https://datasheet.ciiva.com/22668/1678782-22668424.pdf; ComponentLink2Description: https://datasheet.ciiva.com/22668/1678782-22668424.pdf; ComponentLink3URL: https://datasheet.ciiva.com/9181/aoa0000ce2-9181017.pdf; ComponentLink3Description: https://datasheet.ciiva.com/9181/aoa0000ce2-9181017.pdf; ComponentLink4URL: https://datasheet.ciiva.com/24031/aoa0000ce2-24031849.pdf; ComponentLink4Description: https://datasheet.ciiva.com/24031/aoa0000ce2-24031849.pdf; ComponentLink5URL: https://datasheet.ciiva.com/46420/1678782-46420010.pdf; ComponentLink5Description: https://datasheet.ciiva.com/46420/1678782-46420010.pdf; ComponentLink6URL: https://datasheet.ciiva.com/16768/70260748-16768539.pdf; ComponentLink6Description: https://datasheet.ciiva.com/16768/70260748-16768539.pdf; ComponentLink7URL: https://datasheet.ciiva.com/16778/70260748-16778396.pdf; ComponentLink7Description: https://datasheet.ciiva.com/16778/70260748-16778396.pdf; ComponentLink8URL: https://datasheet.ciiva.com/30145/aoa0000ce2-30145500.pdf; ComponentLink8Description: https://datasheet.ciiva.com/30145/aoa0000ce2-30145500.pdf; Supplier Part Number 1: 2303298
R6 R7 R9 R12 R13 = 10K: TE CONNECTIVITY / NEOHM         CPF0603F10KC1             SMD Chip Resistor, Thin Film, 10 kohm, 50 V, 0603 [1608 Metric], 63 mW,  1%, CPF Series; Manufacturer: TE Connectivity Neohm; SVHC: To Be Advised; Product Range: TE CONNECTIVITY - CPF Series; Resistance: 10kohm; Power Rating: 63mW; Temperature Coefficient: ± 50ppm/°C; Voltage Rating: 60V; Climatic Category: 55/125/55; External Depth: 0.45mm; External Length / Height: 1.6mm; External Width: 0.8mm; No. of Pins: 2; Overload Voltage: 120V; Supplier 1: Farnell; Manufacturer Part Number: CPF0603F10KC1; Stock 1: 0; Resistor Element Type: Thin Film; Resistance Tolerance: ± 1%; Resistor Case Style: 0603 [1608 Metric]; Resistor Element Material: Thin Film; Packaging: Cut Tape; MSL: (Not Available); Operating Temperature Max: 125°C; Operating Temperature Min: -55°C; Operating Temperature Range: -55°C to +125°C; Package / Case: 0603; Resistor Mounting: SMD; Series: CPF; ComponentLink1URL: https://datasheet.ciiva.com/24494/29261eng-ds-1773200-f-24494553.pdf; ComponentLink1Description: https://datasheet.ciiva.com/24494/29261eng-ds-1773200-f-24494553.pdf; ComponentLink2URL: https://datasheet.ciiva.com/7789/eng-ds-1773200-j-7789563.pdf; ComponentLink2Description: https://datasheet.ciiva.com/7789/eng-ds-1773200-j-7789563.pdf; ComponentLink3URL: https://datasheet.ciiva.com/16902/eng-ds-1773200-i-16902044.pdf; ComponentLink3Description: https://datasheet.ciiva.com/16902/eng-ds-1773200-i-16902044.pdf; ComponentLink4URL: https://datasheet.ciiva.com/22692/1786775-22692861.pdf; ComponentLink4Description: https://datasheet.ciiva.com/22692/1786775-22692861.pdf; Supplier Part Number 1: 1527581RL
R8 = 1K: Thick Film Resistors - SMD CRGH0603 1% 1K0 0.2W; Manufacturer: TE Connectivity; Manufacturer Part Number: CRGH0603F1K0; Resistance: 1kohm; Voltage Rating: 50V; Resistor Case Style: 0603 [1608 Metric]; Power Rating: 200mW; Product Range: CRG Series; Temperature Coefficient: ± 100ppm/°C; SVHC: No SVHC (15-Jun-2015); Supplier 1: Farnell; Stock 1: 4245; Pricing 1: 10=0.0159, 100=0.0135, 500=0.0104, 1000=0.0093, 2500=0.0088 (EUR); Resistance Tolerance: ± 1%; Packaging: Cut Tape; Resistor Element Type: Thick Film; Automotive Qualification Standard: -; MSL: -; ComponentLink1URL: https://datasheet.ciiva.com/46386/1755795-46386536.pdf; ComponentLink1Description: https://datasheet.ciiva.com/46386/1755795-46386536.pdf; ComponentLink2URL: https://datasheet.ciiva.com/22707/1755795-22707917.pdf; ComponentLink2Description: https://datasheet.ciiva.com/22707/1755795-22707917.pdf; ComponentLink3URL: https://datasheet.ciiva.com/12574/eng-ds-1773204-g-12574479.pdf; ComponentLink3Description: https://datasheet.ciiva.com/12574/eng-ds-1773204-g-12574479.pdf; Supplier Part Number 1: 2332003
R10 = 120R: RES SMD 120 OHM 1% 1/10W 0603; Manufacturer: Vishay; Manufacturer Part Number: CRCW0603120RFKEA; Brand: Vishay / Dale; Resistance: 120 Ohms; Power Rating: 100 mW; Temperature Coefficient: 100 PPM / K; Voltage Rating: 75 V; Unit Weight: 0.000071 oz; Supplier 1: Farnell; Stock 1: 0; Product Category: Thick Film Resistors - SMD; RoHS: Details; Tolerance: 1 %; Case Code - in: 0603; Case Code - mm: 1608; Operating Temperature Range: - 55 C to + 155 C; Series: CRCW; Height: 0.45 mm; Length: 1.55 mm; Package / Case: 0603 (1608 metric); Packaging: Reel; Product: Thick Film Resistors SMD; Factory Pack Quantity: 5000; Termination Style: SMD/SMT; Width: 0.85 mm; ComponentLink1URL: https://datasheet.ciiva.com/11811/0900766b80d98afc-11811523.pdf; ComponentLink1Description: https://datasheet.ciiva.com/11811/0900766b80d98afc-11811523.pdf; ComponentLink2URL: https://datasheet.ciiva.com/2513/dcrcwe3-2513575.pdf; ComponentLink2Description: https://datasheet.ciiva.com/2513/dcrcwe3-2513575.pdf; ComponentLink3URL: https://datasheet.ciiva.com/2513/dcrcwe3-2513576.pdf; ComponentLink3Description: https://datasheet.ciiva.com/2513/dcrcwe3-2513576.pdf; ComponentLink4URL: https://datasheet.ciiva.com/26316/fld-crcw-e3-data-en-26316568.pdf; ComponentLink4Description: https://datasheet.ciiva.com/26316/fld-crcw-e3-data-en-26316568.pdf; ComponentLink5URL: https://datasheet.ciiva.com/2513/dcrcwe3-2513577.pdf; ComponentLink5Description: https://datasheet.ciiva.com/2513/dcrcwe3-2513577.pdf; ComponentLink6URL: https://datasheet.ciiva.com/5544/dcrcwe3-109170-5544139.pdf; ComponentLink6Description: https://datasheet.ciiva.com/5544/dcrcwe3-109170-5544139.pdf; ComponentLink7URL: https://datasheet.ciiva.com/7777/1533075-7777275.pdf; ComponentLink7Description: https://datasheet.ciiva.com/7777/1533075-7777275.pdf; ComponentLink8URL: https://datasheet.ciiva.com/7777/1697337-7777276.pdf; ComponentLink8Description: https://datasheet.ciiva.com/7777/1697337-7777276.pdf; ComponentLink9URL: https://datasheet.ciiva.com/16725/70201119-16725181.pdf; ComponentLink9Description: https://datasheet.ciiva.com/16725/70201119-16725181.pdf; Supplier Part Number 1: 1652832RL
R18 = 1M1: Manufacturer: Multicomp; Manufacturer Part Number: MCHVR03FTFX1104; Supplier 1: Farnell; Stock 1: 10000; Pricing 1: 5000=0.0122, 25000=0.0088 (EUR); Supplier Part Number 1: 2823300
R19 = 210K: Thick Film Resistors - SMD 1/10watt 210Kohms 1%; Manufacturer: Vishay; Manufacturer Part Number: CRCW0603210KFKEA; Brand: Vishay / Dale; Power Rating: 100 mW; Temperature Coefficient: 100 PPM / K; Voltage Rating: 75 V; Case Height: 0.45 mm; Case Length: 1.55 mm; Case Width: 0.85 mm; Unit Weight: 0.000071 oz; Supplier 1: Farnell; Stock 1: 17185; Pricing 1: 10=0.0283, 100=0.0198, 500=0.0145, 1000=0.0091 (EUR); Product Category: Thick Film Resistors - SMD; RoHS: Details; Resistance: 210 kOhms; Tolerance: 1 %; Case Code - in: 0603; Case Code - mm: 1608; Operating Temperature Range: - 55 C to + 155 C; Package / Case: 0603 (1608 metric); Packaging: Reel; Product: Thick Film Resistors SMD; Series: CRCW; Factory Pack Quantity: 5000; ComponentLink1URL: https://datasheet.ciiva.com/5544/dcrcwe3-109170-5544760.pdf; ComponentLink1Description: https://datasheet.ciiva.com/5544/dcrcwe3-109170-5544760.pdf; ComponentLink2URL: https://datasheet.ciiva.com/16883/dcrcwe3-16883336.pdf; ComponentLink2Description: https://datasheet.ciiva.com/16883/dcrcwe3-16883336.pdf; ComponentLink3URL: https://datasheet.ciiva.com/22871/70201119-22871881.pdf; ComponentLink3Description: https://datasheet.ciiva.com/22871/70201119-22871881.pdf; ComponentLink4URL: https://datasheet.ciiva.com/16779/70201119-16779626.pdf; ComponentLink4Description: https://datasheet.ciiva.com/16779/70201119-16779626.pdf; ComponentLink5URL: https://datasheet.ciiva.com/7673/1697337-7673292.pdf; ComponentLink5Description: https://datasheet.ciiva.com/7673/1697337-7673292.pdf; ComponentLink6URL: https://datasheet.ciiva.com/7673/1697337-7673293.pdf; ComponentLink6Description: https://datasheet.ciiva.com/7673/1697337-7673293.pdf; ComponentLink7URL: https://datasheet.ciiva.com/16449/dcrcwe3-16449149.pdf; ComponentLink7Description: https://datasheet.ciiva.com/16449/dcrcwe3-16449149.pdf; ComponentLink8URL: https://datasheet.ciiva.com/22705/1697337-22705951.pdf; ComponentLink8Description: https://datasheet.ciiva.com/22705/1697337-22705951.pdf; Supplier Part Number 1: 2138527
SW1 = KMR221NGLFS: SWITCH TACTILE SPST-NO 0.05A 32V; Manufacturer: ITT C&K; Pole Throw Configuration: SPST; Mechanical Life: 200000 Cycles; Switch Configuration: N.O.; Illumination Type: N/R; Ground Terminal: No; Body Orientation: Straight; Actuator Length: 0.5 mm; Operating Force: 2 N; Actuator Style: Round Button; Dielectric Strength: >=250 Vrms; Minimum Insulation Resistance: >=1000 MOhm; Contact Rating @ Voltage: 1 A; Supplier 1: C&K Components; Manufacturer Part Number: KMR221NGLFS; Stock 1: 5345; Pricing 1: 10=0.278, 500=0.264, 1000=0.208, 5000=0.204, 10000=0.2 (GBP); Part No: KMR221NGLFS; RoHS: Yes; Supplier Standard Pack: 7,000; Type: Micro-Miniature; Maximum AC Voltage Rating: N/A; Family: KMR 2; Contact Material: Silver; Actuator Color: N/A; Maximum DC Voltage Rating: 32 V; Seal Description: N/A; Packaging: Tape and Reel; Contact Plating: Silver; Electrical Life: N/A; Housing Material: N/A; Product Weight: N/A; Base Material: N/A; Mounting: Surface Mount,Gull Wing; Seal Location: N/A; Operating Temperature: -40 to 85 C; Dimension: 2.8 x 4.6 x 1.9 mm; HTS: 8536501199; ECCN: EAR99; ComponentLink1URL: https://datasheet.ciiva.com/16443/kmr221nglfs-16443038.pdf; ComponentLink1Description: https://datasheet.ciiva.com/16443/kmr221nglfs-16443038.pdf; ComponentLink2URL: https://datasheet.ciiva.com/2900/kmr2-9aug12-2900169.pdf; ComponentLink2Description: https://datasheet.ciiva.com/2900/kmr2-9aug12-2900169.pdf; ComponentLink3URL: https://datasheet.ciiva.com/2900/kmr2-9aug12-2900170.pdf; ComponentLink3Description: https://datasheet.ciiva.com/2900/kmr2-9aug12-2900170.pdf; ComponentLink4URL: https://datasheet.ciiva.com/16695/kmr2-9aug12-16695914.pdf; ComponentLink4Description: https://datasheet.ciiva.com/16695/kmr2-9aug12-16695914.pdf; ComponentLink5URL: https://datasheet.ciiva.com/2900/kmr2-9aug12-2900171.pdf; ComponentLink5Description: https://datasheet.ciiva.com/2900/kmr2-9aug12-2900171.pdf; Supplier Part Number 1: 2845727
T1-T9 = Test_pad: Test point
U1 = MCP25625-E/ML: MICROCHIP         MCP25625-E/ML            CAN Bus, Controller with Transceiver, CAN, SPI, 3, 2, 2.7 V, 5.5 V, QFN; Data Rate: 1 Mb/s; Supply Voltage - Max: 5.5 V; Supply Voltage - Min: 2.7 V, 4.5 V; Operating Supply Current: 70 mA; Brand: Microchip Technology; Interface Type: Serial, 4-Wire, SPI; Isolation Type: Non-Isolated; Number of Drivers: 1 Driver; Number of Receivers: 1 Receiver; Number of Transceivers: 1 Transceiver; Operating Supply Voltage: 4.5 V to 5.5 V; Propagation Delay Time: 125 ns; Protocol Supported: CAN 2.0B; Unit Weight: 0.002497 oz; Supplier 1: Farnell; Manufacturer: Microchip; Manufacturer Part Number: MCP25625-E/ML; Stock 1: 82; Pricing 1: 1=2.28, 10=2.08, 25=1.87, 100=1.71 (EUR); Product Category: CAN Interface IC; RoHS: True; Type: CAN Controller/Transceiver; Maximum Operating Temperature: + 125 C; Minimum Operating Temperature: - 40 C; Mounting Style: SMD/SMT; Package / Case: QFN-28; Packaging: Bulk; Product: CAN Controllers; Series: MCP2562; Factory Pack Quantity: 61; ComponentLink1URL: http://ww1.microchip.com/downloads/en/DeviceDoc/20005282A.pdf; ComponentLink1Description: http://ww1.microchip.com/downloads/en/DeviceDoc/20005282A.pdf; ComponentLink2URL: http://uk.rs-online.com/webdocs/137c/0900766b8137cddf.pdf; ComponentLink2Description: http://uk.rs-online.com/webdocs/137c/0900766b8137cddf.pdf; ComponentLink3URL: http://www.mouser.com/ds/2/268/20005282B-708896.pdf; ComponentLink3Description: http://www.mouser.com/ds/2/268/20005282B-708896.pdf; ComponentLink4URL: https://www.distrelec.biz/Web/Downloads/_t/ds/MCP25625_eng_tds.pdf?mime=application%2Fpdf; ComponentLink4Description: https://www.distrelec.biz/Web/Downloads/_t/ds/MCP25625_eng_tds.pdf?mime=application%2Fpdf; ComponentLink5URL: http://www.farnell.com/datasheets/1821191.pdf; ComponentLink5Description: http://www.farnell.com/datasheets/1821191.pdf; ComponentLink6URL: http://www.microchip.com/mymicrochip/filehandler.aspx?ddocname=en568896; ComponentLink6Description: http://www.microchip.com/mymicrochip/filehandler.aspx?ddocname=en568896; Supplier Part Number 1: 2448754
U2 U3 = TPS62125DSGR: Voltage Regulators - Switching Regulators 3V-17V, 300mA Buck Converter; Manufacturer: Texas Instruments; Featured Product: WEBENCH Design Center; Output Type: Adjustable; Number of Outputs: 1; Voltage - Output: 1.2 V ~ 10 V; Voltage - Input: 3 V ~ 17 V; PWM Type: Hybrid; Frequency - Switching: 1MHz; Synchronous Rectifier: Yes; Supplier 1: Farnell; Manufacturer Part Number: TPS62125DSGR; Stock 1: 0; Standard Package: 3,000; Category: Integrated Circuits (ICs); Family: PMIC - Voltage Regulators - DC DC Switching Regulators; Series: DCS-Control™; Type: Step-Down (Buck); Current - Output: 300mA; Operating Temperature: -40°C ~ 85°C; Mounting Type: *; Package / Case: *; Packaging: *; Supplier Device Package: *; ComponentLink1URL: https://datasheet.ciiva.com/28375/tps62125-28375971.pdf; ComponentLink1Description: https://datasheet.ciiva.com/28375/tps62125-28375971.pdf; ComponentLink2URL: https://datasheet.ciiva.com/6598/tps62125-6598733.pdf; ComponentLink2Description: https://datasheet.ciiva.com/6598/tps62125-6598733.pdf; Supplier Part Number 1: 2769414RL
U4 = Lora Module Murata ES0: Lora Module Murata
X1 = LFXTAL059585: IQD FREQUENCY PRODUCTS         LFXTAL059585             CRYSTAL, 20MHZ, 10PF, 2MM X 1.6MM                          New; Crystal Case: SMD, 2mm x 1.6mm; Frequency Stability + / -: 20ppm; Frequency Tolerance + / -: 15ppm; Product Range: IQXC-42 20MHZ Series; SVHC: No SVHC (20-Jun-2016); Supplier 1: Farnell; Manufacturer: IQD; Manufacturer Part Number: LFXTAL059585; Stock 1: 62; Pricing 1: 1=0.815, 5=0.783, 10=0.765, 20=0.747, 40=0.729, 100=0.711, 500=0.693 (EUR); Frequency Nom: 20MHz; Load Capacitance: 10pF; Operating Temperature Min: -40°C; Operating Temperature Max: 85°C; ComponentLink1URL: http://www.farnell.com/datasheets/2117914.pdf; ComponentLink1Description: http://www.farnell.com/datasheets/2117914.pdf; Supplier Part Number 1: 2627212